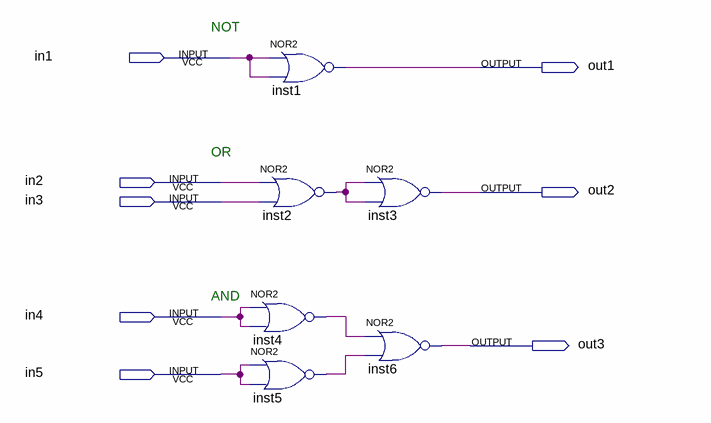
[diagram p0: schematic sheet]
// Quartus schematic Univer_Portas_NOR.bdf as structural Verilog: 6 symbols, 8 pins
module Univer_Portas_NOR (
  input  in1,
  input  in2,
  input  in3,
  input  in4,
  input  in5,
  output out1,
  output out2,
  output out3
);

  wire inst2_out, inst4_out, inst5_out;

  nor inst1 (out1, in1, in1);
  nor inst2 (inst2_out, in2, in3);
  nor inst4 (inst4_out, in4, in4);
  nor inst5 (inst5_out, in5, in5);
  nor inst3 (out2, inst2_out, inst2_out);
  nor inst6 (out3, inst4_out, inst5_out);

  // Notes on the sheet:
  //   NOT
  //   OR
  //   AND
endmodule
